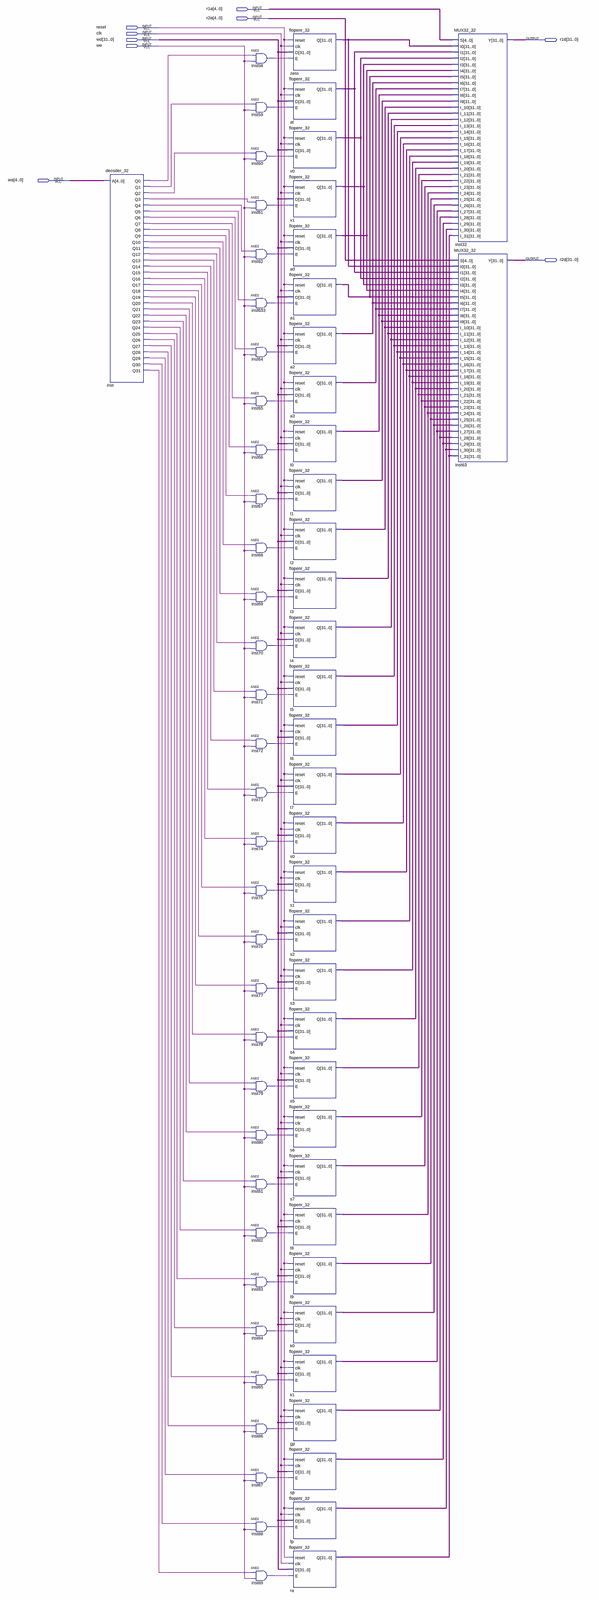
[diagram p0: schematic sheet, whole]
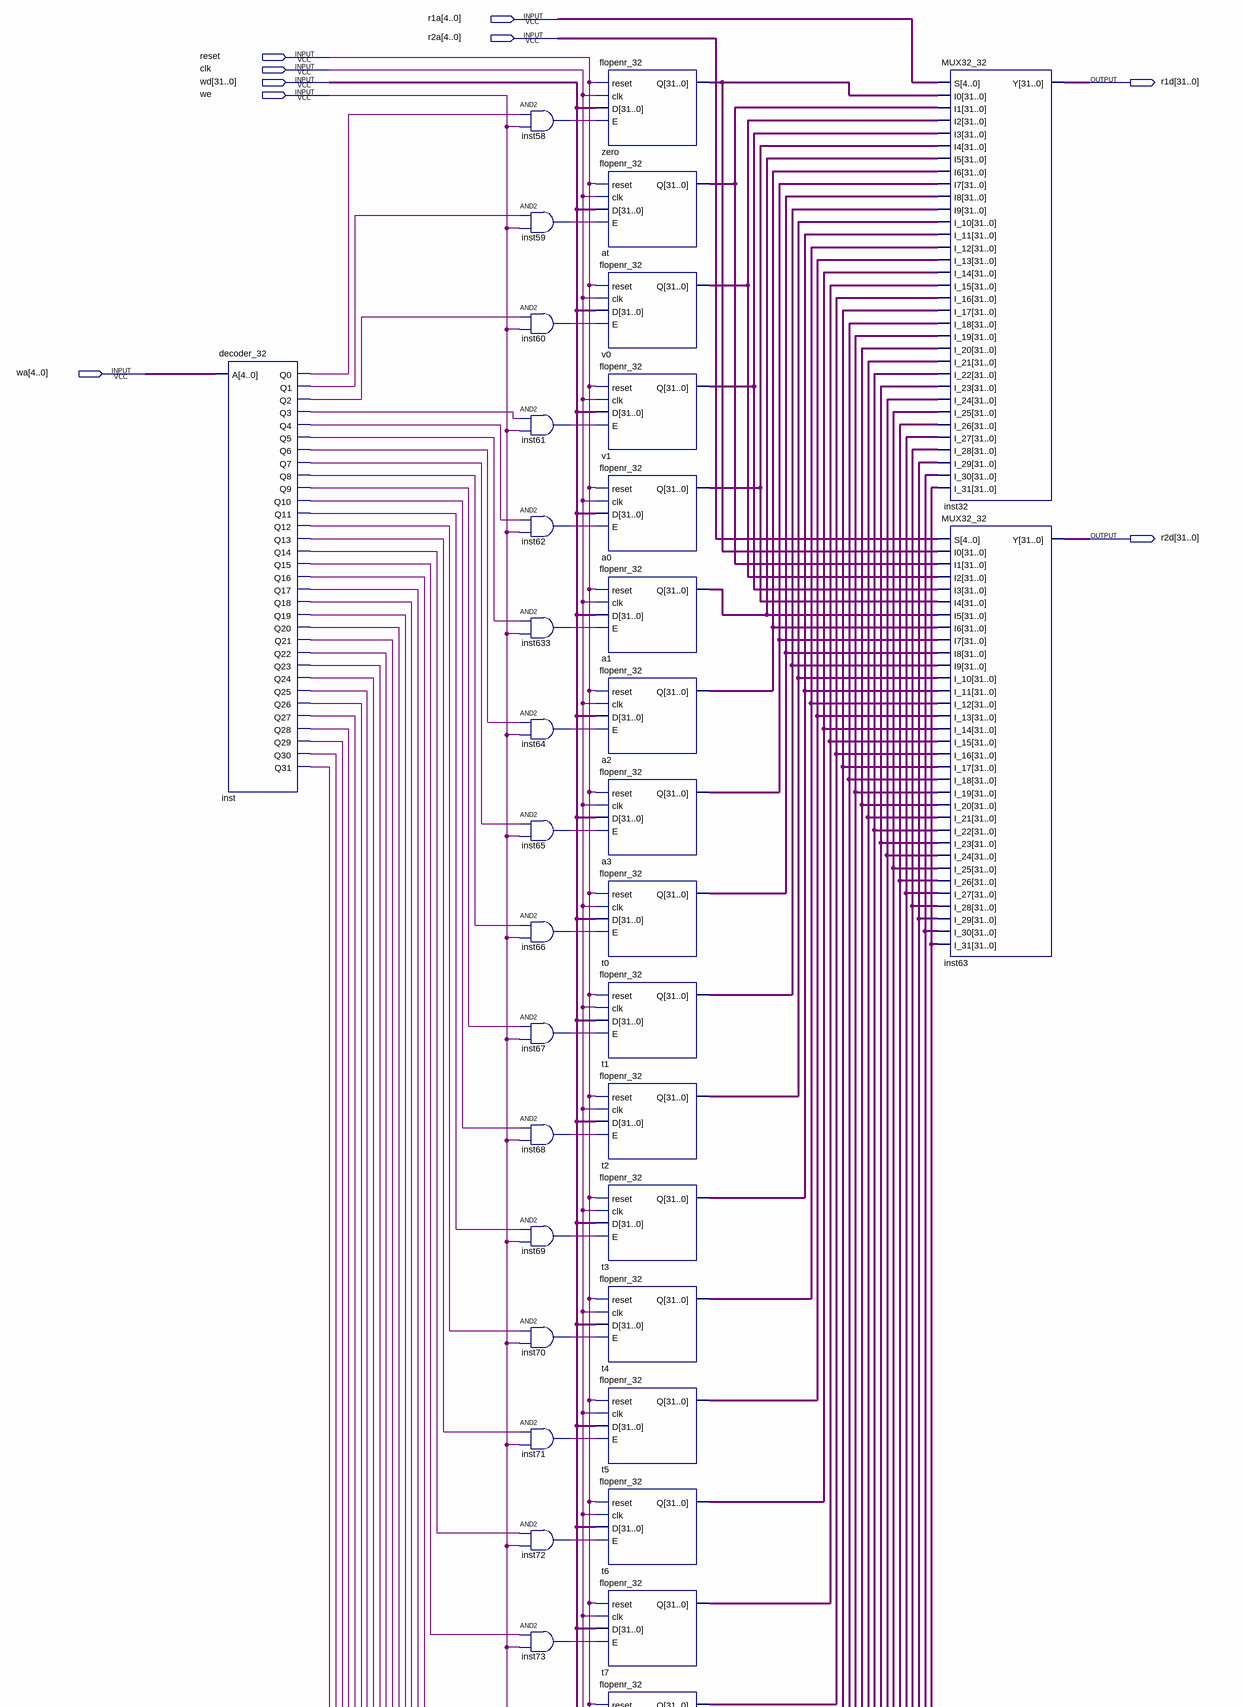
[diagram p1: schematic sheet, upper part]
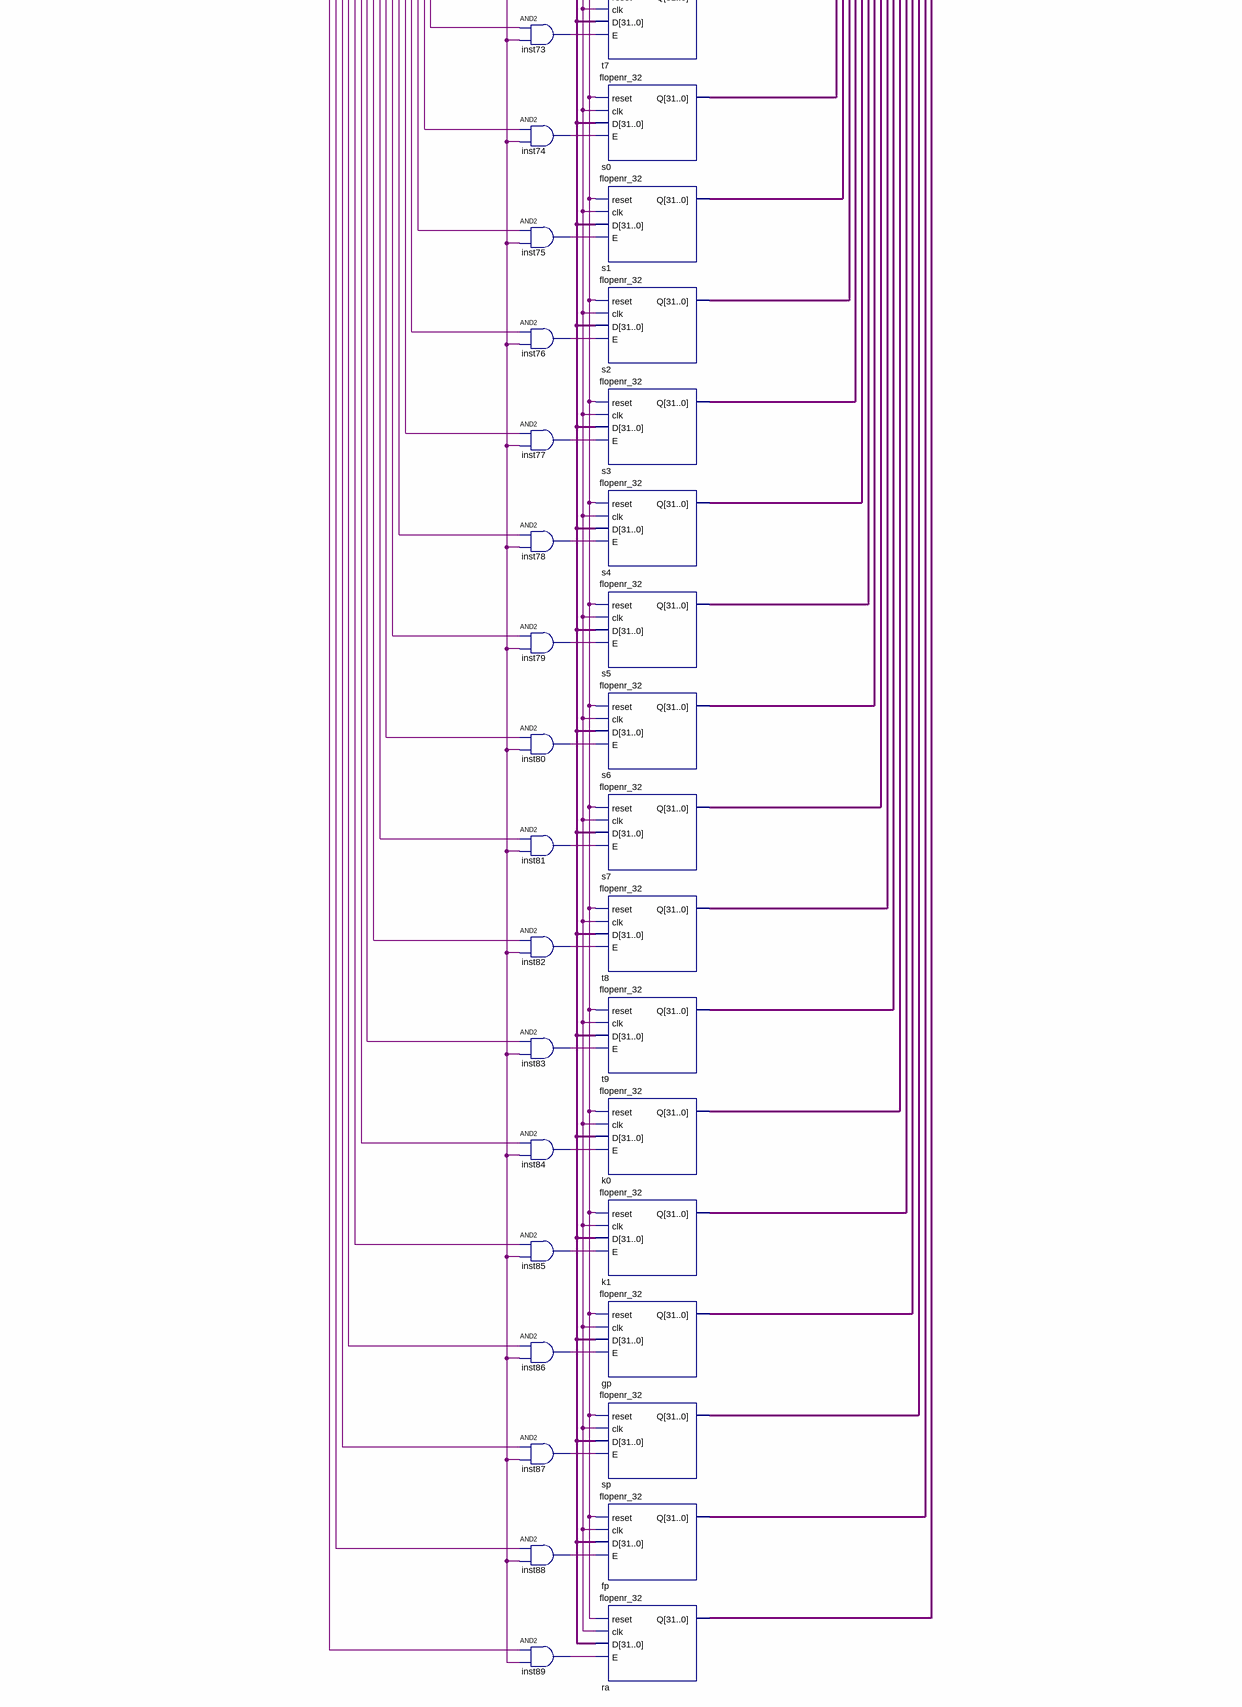
[diagram p2: schematic sheet, lower part]
// Quartus schematic RF.bdf as structural Verilog: 67 symbols, 9 pins
module RF (
  input  [4:0] r1a,
  input  [4:0] r2a,
  input  reset,
  input  clk,
  input  [31:0] wd,
  input  we,
  input  [4:0] wa,
  output [31:0] r1d,
  output [31:0] r2d
);

  wire inst58_out, inst59_out, inst60_out, inst61_out, inst62_out, inst64_out, inst65_out, inst66_out,
       inst67_out, inst68_out, inst69_out, inst70_out, inst71_out, inst72_out, inst73_out, inst74_out,
       inst75_out, inst76_out, inst77_out, inst78_out, inst79_out, inst80_out, inst81_out, inst82_out,
       inst83_out, inst84_out, inst85_out, inst86_out, inst87_out, inst88_out, inst89_out, inst633_out,
       inst_q0, inst_q1, inst_q2, inst_q3, inst_q4, inst_q5, inst_q6, inst_q7, inst_q8, inst_q9, inst_q10,
       inst_q11, inst_q12, inst_q13, inst_q14, inst_q15, inst_q16, inst_q17, inst_q18, inst_q19, inst_q20,
       inst_q21, inst_q22, inst_q23, inst_q24, inst_q25, inst_q26, inst_q27, inst_q28, inst_q29, inst_q30,
       inst_q31;
  wire [31:0] a0_q, a1_q, a2_q, a3_q, at_q, fp_q, gp_q, k0_q, k1_q, ra_q, s0_q, s1_q, s2_q, s3_q, s4_q, s5_q,
       s6_q, s7_q, sp_q, t0_q, t1_q, t2_q, t3_q, t4_q, t5_q, t6_q, t7_q, t8_q, t9_q, v0_q, v1_q, zero_q;

  decoder_32 inst (
    .A(wa), .Q0(inst_q0), .Q1(inst_q1), .Q2(inst_q2), .Q3(inst_q3), .Q4(inst_q4), .Q5(inst_q5), .Q6(inst_q6),
    .Q7(inst_q7), .Q8(inst_q8), .Q9(inst_q9), .Q10(inst_q10), .Q11(inst_q11), .Q12(inst_q12), .Q13(inst_q13),
    .Q14(inst_q14), .Q15(inst_q15), .Q16(inst_q16), .Q17(inst_q17), .Q18(inst_q18), .Q19(inst_q19),
    .Q20(inst_q20), .Q21(inst_q21), .Q22(inst_q22), .Q23(inst_q23), .Q24(inst_q24), .Q25(inst_q25),
    .Q26(inst_q26), .Q27(inst_q27), .Q28(inst_q28), .Q29(inst_q29), .Q30(inst_q30), .Q31(inst_q31));
  and inst58 (inst58_out, inst_q0, we);
  and inst59 (inst59_out, inst_q1, we);
  and inst60 (inst60_out, inst_q2, we);
  and inst61 (inst61_out, inst_q3, we);
  and inst62 (inst62_out, inst_q4, we);
  and inst633 (inst633_out, inst_q5, we);
  and inst64 (inst64_out, inst_q6, we);
  and inst65 (inst65_out, inst_q7, we);
  and inst66 (inst66_out, inst_q8, we);
  and inst67 (inst67_out, inst_q9, we);
  and inst68 (inst68_out, inst_q10, we);
  and inst69 (inst69_out, inst_q11, we);
  and inst70 (inst70_out, inst_q12, we);
  and inst71 (inst71_out, inst_q13, we);
  and inst72 (inst72_out, inst_q14, we);
  and inst73 (inst73_out, inst_q15, we);
  and inst74 (inst74_out, inst_q16, we);
  and inst75 (inst75_out, inst_q17, we);
  and inst76 (inst76_out, inst_q18, we);
  and inst77 (inst77_out, inst_q19, we);
  and inst78 (inst78_out, inst_q20, we);
  and inst79 (inst79_out, inst_q21, we);
  and inst80 (inst80_out, inst_q22, we);
  and inst81 (inst81_out, inst_q23, we);
  and inst82 (inst82_out, inst_q24, we);
  and inst83 (inst83_out, inst_q25, we);
  and inst84 (inst84_out, inst_q26, we);
  and inst85 (inst85_out, inst_q27, we);
  and inst86 (inst86_out, inst_q28, we);
  and inst87 (inst87_out, inst_q29, we);
  and inst88 (inst88_out, inst_q30, we);
  and inst89 (inst89_out, inst_q31, we);
  flopenr_32 zero (.reset(reset), .clk(clk), .D(wd), .E(inst58_out), .Q(zero_q));
  flopenr_32 at (.reset(reset), .clk(clk), .D(wd), .E(inst59_out), .Q(at_q));
  flopenr_32 v0 (.reset(reset), .clk(clk), .D(wd), .E(inst60_out), .Q(v0_q));
  flopenr_32 v1 (.reset(reset), .clk(clk), .D(wd), .E(inst61_out), .Q(v1_q));
  flopenr_32 a0 (.reset(reset), .clk(clk), .D(wd), .E(inst62_out), .Q(a0_q));
  flopenr_32 a1 (.reset(reset), .clk(clk), .D(wd), .E(inst633_out), .Q(a1_q));
  flopenr_32 a2 (.reset(reset), .clk(clk), .D(wd), .E(inst64_out), .Q(a2_q));
  flopenr_32 a3 (.reset(reset), .clk(clk), .D(wd), .E(inst65_out), .Q(a3_q));
  flopenr_32 t0 (.reset(reset), .clk(clk), .D(wd), .E(inst66_out), .Q(t0_q));
  flopenr_32 t1 (.reset(reset), .clk(clk), .D(wd), .E(inst67_out), .Q(t1_q));
  flopenr_32 t2 (.reset(reset), .clk(clk), .D(wd), .E(inst68_out), .Q(t2_q));
  flopenr_32 t3 (.reset(reset), .clk(clk), .D(wd), .E(inst69_out), .Q(t3_q));
  flopenr_32 t4 (.reset(reset), .clk(clk), .D(wd), .E(inst70_out), .Q(t4_q));
  flopenr_32 t5 (.reset(reset), .clk(clk), .D(wd), .E(inst71_out), .Q(t5_q));
  flopenr_32 t6 (.reset(reset), .clk(clk), .D(wd), .E(inst72_out), .Q(t6_q));
  flopenr_32 t7 (.reset(reset), .clk(clk), .D(wd), .E(inst73_out), .Q(t7_q));
  flopenr_32 s0 (.reset(reset), .clk(clk), .D(wd), .E(inst74_out), .Q(s0_q));
  flopenr_32 s1 (.reset(reset), .clk(clk), .D(wd), .E(inst75_out), .Q(s1_q));
  flopenr_32 s2 (.reset(reset), .clk(clk), .D(wd), .E(inst76_out), .Q(s2_q));
  flopenr_32 s3 (.reset(reset), .clk(clk), .D(wd), .E(inst77_out), .Q(s3_q));
  flopenr_32 s4 (.reset(reset), .clk(clk), .D(wd), .E(inst78_out), .Q(s4_q));
  flopenr_32 s5 (.reset(reset), .clk(clk), .D(wd), .E(inst79_out), .Q(s5_q));
  flopenr_32 s6 (.reset(reset), .clk(clk), .D(wd), .E(inst80_out), .Q(s6_q));
  flopenr_32 s7 (.reset(reset), .clk(clk), .D(wd), .E(inst81_out), .Q(s7_q));
  flopenr_32 t8 (.reset(reset), .clk(clk), .D(wd), .E(inst82_out), .Q(t8_q));
  flopenr_32 t9 (.reset(reset), .clk(clk), .D(wd), .E(inst83_out), .Q(t9_q));
  flopenr_32 k0 (.reset(reset), .clk(clk), .D(wd), .E(inst84_out), .Q(k0_q));
  flopenr_32 k1 (.reset(reset), .clk(clk), .D(wd), .E(inst85_out), .Q(k1_q));
  flopenr_32 gp (.reset(reset), .clk(clk), .D(wd), .E(inst86_out), .Q(gp_q));
  flopenr_32 sp (.reset(reset), .clk(clk), .D(wd), .E(inst87_out), .Q(sp_q));
  flopenr_32 fp (.reset(reset), .clk(clk), .D(wd), .E(inst88_out), .Q(fp_q));
  flopenr_32 ra (.reset(reset), .clk(clk), .D(wd), .E(inst89_out), .Q(ra_q));
  MUX32_32 inst32 (
    .S(r1a), .I0(zero_q), .I1(at_q), .I2(v0_q), .I3(v1_q), .I4(a0_q), .I5(a1_q), .I6(a2_q), .I7(a3_q),
    .I8(t0_q), .I9(t1_q), .I_10(t2_q), .I_11(t3_q), .I_12(t4_q), .I_13(t5_q), .I_14(t6_q), .I_15(t7_q),
    .I_16(s0_q), .I_17(s1_q), .I_18(s2_q), .I_19(s3_q), .I_20(s4_q), .I_21(s5_q), .I_22(s6_q), .I_23(s7_q),
    .I_24(t8_q), .I_25(t9_q), .I_26(k0_q), .I_27(k1_q), .I_28(gp_q), .I_29(sp_q), .I_30(fp_q), .I_31(ra_q),
    .Y(r1d));
  MUX32_32 inst63 (
    .S(r2a), .I0(zero_q), .I1(at_q), .I2(v0_q), .I3(v1_q), .I4(a0_q), .I5(a1_q), .I6(a2_q), .I7(a3_q),
    .I8(t0_q), .I9(t1_q), .I_10(t2_q), .I_11(t3_q), .I_12(t4_q), .I_13(t5_q), .I_14(t6_q), .I_15(t7_q),
    .I_16(s0_q), .I_17(s1_q), .I_18(s2_q), .I_19(s3_q), .I_20(s4_q), .I_21(s5_q), .I_22(s6_q), .I_23(s7_q),
    .I_24(t8_q), .I_25(t9_q), .I_26(k0_q), .I_27(k1_q), .I_28(gp_q), .I_29(sp_q), .I_30(fp_q), .I_31(ra_q),
    .Y(r2d));
endmodule
